# Altium schematic sheet FPGA_RESET.SchDoc: FPGA RESET
size A4
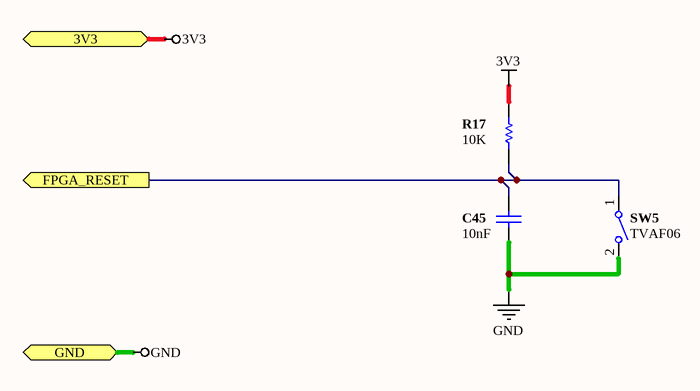
[diagram p0: FPGA_RESET.SchDoc]

## Parts
C45  value 10nF  [CAPC0402(1005)60_N]  (hidden comment: CAP 10nF 6.3V 0402(1005))
R17  value 10K  [RESC0402(1005)_N]  (hidden comment: 10K 1% 0402(1005))
SW5  TVAF06  [JNFU-TVAF06-2]

## Ports
3V3, FPGA_RESET (out), GND

## Nets
3V3: R17.1 ; port 3V3
GND: C45.2 SW5.2(B1) ; port GND
FPGA_RESET: C45.1 R17.2 SW5.1(A1) ; port FPGA_RESET

## Notes on the sheet
- Sheet Title
- Project Title
- Size:
- Date:
- A4
- Item:
- Time:
- Revision:
- Sheet
- of
- File:

## Library data of the parts
C45 = CMP-1034-01869-1: CAP 10nF 6.3V ?0% 0402 (1005 Metric) Thickness 0.6mm SMD; Case-EIA: 0402; Case-Metric: 1005; Technology: SMT; Tolerance: ?0%; Max Thickness: 0.6 mm; Rated Voltage: 6.3 V
R17 = CMP-1011-00623-1: 10K 0.063W 1% 0402 (1005 Metric)  SMD; Case-Metric: 1005; Case-EIA: 0402; Tolerance: 1 %; Technology: SMT; Power: 0.063 W
SW5 = CMP-5298-00001-1: Switch, SPST Push Button, 50mA, 12V DC, SMD; IEC-class: Switches; Mechanical Life: 100,000 cycles; Class: Switch; Datasheet: http://www.jian-fu.com/product-22.html; Operating Temperature: -30 to +85 degC; Case Size: 3.9 X 2.9 mm; Sub-class: SPST